# EAGLE design aasaver2.0 (EAGLE 6.4)
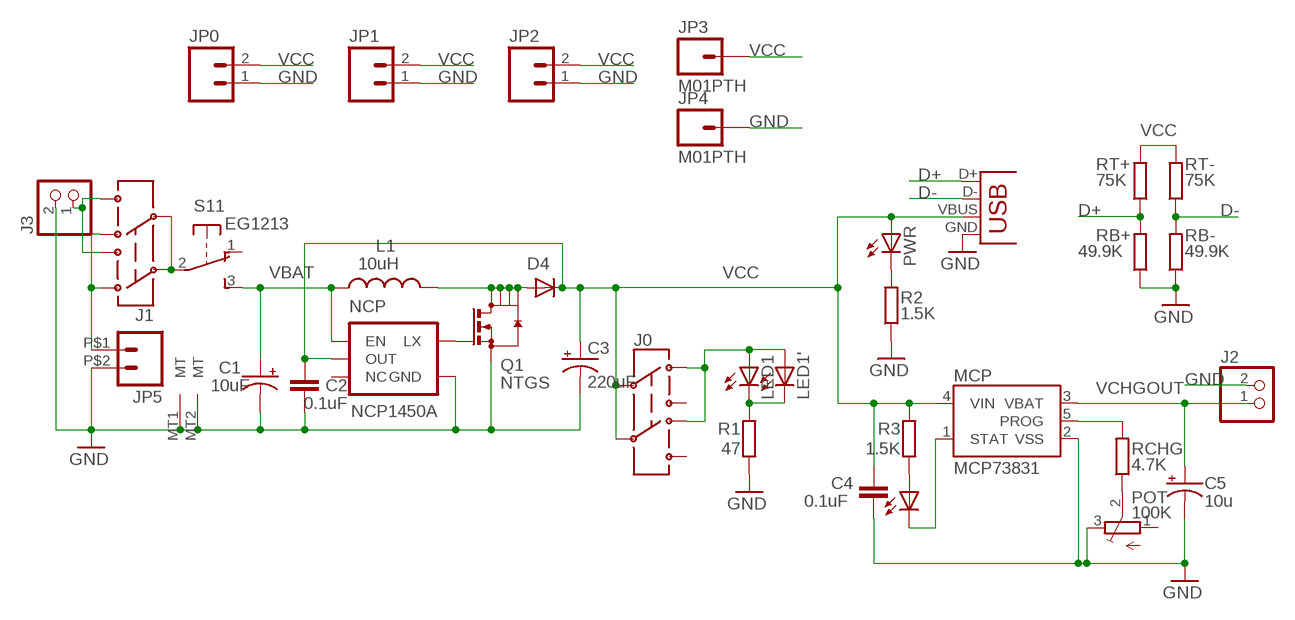
[diagram p0: schematic, sheet 1]

## Parts
C1  10uF  CAP_POL1206  [EIA3216]
C2  0.1uF  C-EUC0805  [C0805]
C3  220uF  CAP_POL7343  [EIA7343]
C4  0.1uF  C-EUC0805  [C0805]
C5  10u  CAP_POL1206  [EIA3216]
D4  DIODEDO216  [DO216AA-DIODE]
J0  AYZ0202  [AYZ0202]
J1  AYZ0202  [AYZ0202]
J2  JST_2PIN-SMT-RA  [JST-PH-2-SMT-RA]
J3  JST_2PIN-SMT-RA  [JST-PH-2-SMT-RA]
JP0  M021X02_NO_SILK  [1X02_NO_SILK]
JP1  M021X02_NO_SILK  [1X02_NO_SILK]
JP2  M021X02_NO_SILK  [1X02_NO_SILK]
JP3  M01PTH  [1X01]
JP4  M01PTH  [1X01]
JP5  M02PTH2  [1X02_BIG]
L1  10uH  INDUCTORCR75  [CR75]
LED1  LED3MM  [LED3MM]
LED1'  LED3MM  [LED3MM]
LED3  green  LEDCHIPLED_0805  [CHIPLED_0805]
MCP  MCP73831  [SOT23-5]
NCP  NCP1450A  V_REG_NCP1400SOT23-5  [SOT23-5]
POT  100K  TRIMPOTTC33X  [TC33X]
PWR  red  LEDCHIPLED_0805  [CHIPLED_0805]
Q1  NTGS  NTGS3446  [SOT236]
R1  47  R-EU_R0805  [R0805]
R2  1.5K  R-EU_R0805  [R0805]
R3  1.5K  R-EU_R0805  [R0805]
RB+  49.9K  R-EU_R0805  [R0805]
RB-  49.9K  R-EU_R0805  [R0805]
RCHG  4.7K  R-EU_R0805  [R0805]
RT+  75K  R-EU_R0805  [R0805]
RT-  75K  R-EU_R0805  [R0805]
S1  EG1213  [EG1213]
X1  USB-A-S-FEMALE  [USB-A-S-FEMALE]

## Nets
D+: RB+.2 RT+.1 X1.D+
D-: RB-.2 RT-.1 X1.D-
GND: C1.C(-) C2.1 C3.C(-) C4.2 C5.C(-) J2.2 J3.2 JP0.1 JP1.1 JP2.1 JP4.1 JP5.P$2 MCP.2(VSS) NCP.4(GND) POT.3(E) Q1.4(S) R1.1 R2.1 RB+.1 RB-.1 S1.MT1(MT) S1.MT2(MT) X1.GND
N$1: NCP.5(LX) Q1.3(G)
N$2 [power]: D4.A L1.P$2 Q1.1(D) Q1.2(D1) Q1.5(D2) Q1.6(D3)
N$3: J1.2 J1.5 S1.2(1:P)
N$4: LED1'.K(C) LED1.K(C) R1.2
N$5: LED3.A R3.1
N$6: J1.3 J1.6 JP5.P$1
N$7: POT.2(S) RCHG.1
N$8: PWR.C R2.2
N$9: LED3.C MCP.1(STAT)
N$10: MCP.5(PROG) RCHG.2
N$11: J1.1 J1.4 J3.1
N$14: J0.3 J0.6 LED1'.A LED1.A
VBAT [power]: C1.A(+) L1.P$1 NCP.1(EN) S1.3(1:S)
VCC [power]: C2.2 C3.A(+) C4.1 D4.C J0.2 J0.5 JP0.2 JP1.2 JP2.2 JP3.1 MCP.4(VIN) NCP.2(OUT) PWR.A R3.2 RT+.2 RT-.2 X1.VBUS
VCHGOUT: C5.A(+) J2.1 MCP.3(VBAT)
Unconnected: J0.1 J0.4 NCP.3(NC) POT.1(A) S1.1(1:O)

## Library data of the parts
C1 C3 C5 = SparkFunNew:CAP_POL: Capacitor Polarized These are standard SMD and PTH capacitors. Normally 10uF, 47uF, and 100uF in electrolytic and tantalum varieties. Always verify the external diameter of the through hole cap, it varies with capacity, voltage, and manufacturer. The EIA devices should be standard.
C2 C4 = resistor:C-EU: CAPACITOR, European symbol
D4 = SparkFun:DIODE: Diode These are standard reverse protection diodes and small signal diodes. SMA package can handle up to about 1A. SOD-323 can handle about 200mA. What the SOD-323 package when ordering, there are some mfgs out there that are 5-pin packages.
J0 J1 = SparkFunNew:AYZ0202: SPDT Slide Switch Simple SMD single-pull double-throw slide switch. Good for less than 350mA power switch, switching UARTs between devices, etc. Spark Fun Electronics SKU : COM-00597
J2 J3 = adafruit:JST_2PIN: JST 2-Pin Connectors of various flavors SMT-RA (S2B-PH-SM4) 4UConnector #17311 SMT (B2B-PH-SM4) THM-RA (S2B-PH) THM (B2B-PH)
JP0 JP1 JP2 JP5 = SparkFun:M02: Header 2 Standard 2-pin 0.1" header. Use with straight break away headers (SKU : PRT-00116), right angle break away headers (PRT-00553), swiss pins (PRT-00743), machine pins (PRT-00117), and female headers (PRT-00115). Molex polarized connector foot print use with SKU : PRT-08233 with associated crimp pins and housings.
JP3 JP4 = SparkFun:M01: Header 1 Standard 1-pin 0.1" header. Use with straight break away headers (SKU : PRT-00116), right angle break away headers (PRT-00553), swiss pins (PRT-00743), machine pins (PRT-00117), and female headers (PRT-00115).
L1 = SparkFun:INDUCTOR: Inductors Basic Inductor/Choke - 0603 and 1206. Footprints are not proven and vary greatly between part numbers.
LED1 LED1' = adafruit:LED: LED
LED3 PWR = led:LED: LED
MCP = SparkFunNew:MCP73831: Microchip's MCP73831 Miniature single cell, fully integrated Li-Ion, Li-polymer charge management controller http://ww1.microchip.com/downloads/en/DeviceDoc/21984a.pdf
NCP = SparkFunNew:V_REG_NCP1400: Switching step-up voltage regulator NCP1400 switiching regulator takes single cell AA and outputs 100mA at 3.3V or 5V with minimal number of external components.
POT = adafruit:TRIMPOT: SMT trimmer potentiometer part number TC33X http://www.ladyada.net/library/eagle
Q1 = transistor-small-signal:NTGS3446
R1-R3 RB+ RB- RCHG RT+ RT- = rcl:R-EU_: RESISTOR, European symbol
S1 = adafruitGood:EG1213: E-Switch right-angle slide SPDT Part #EG1213 http://www.ladyada.net/library/eagle
X1 = SparkFunNew:USB: USB Connectors USB-B-PTH is fully proven SKU : PRT-00139 USB-miniB is fully proven SKU : PRT-00587 USB-A-PCB is untested. USB-A-H is throughly reviewed, but untested. Spark Fun Electronics SKU : PRT-00437 USB-B-SMT is throughly reviewed, but untested. Needs silkscreen touching up. USB-A-S has not been used/tested USB-MB-H has not been used/tested

## Net classes
0 default: width 0.254 mm, clearance 0.203 mm
1 power: width 0.508 mm, clearance 0.203 mm

## Board
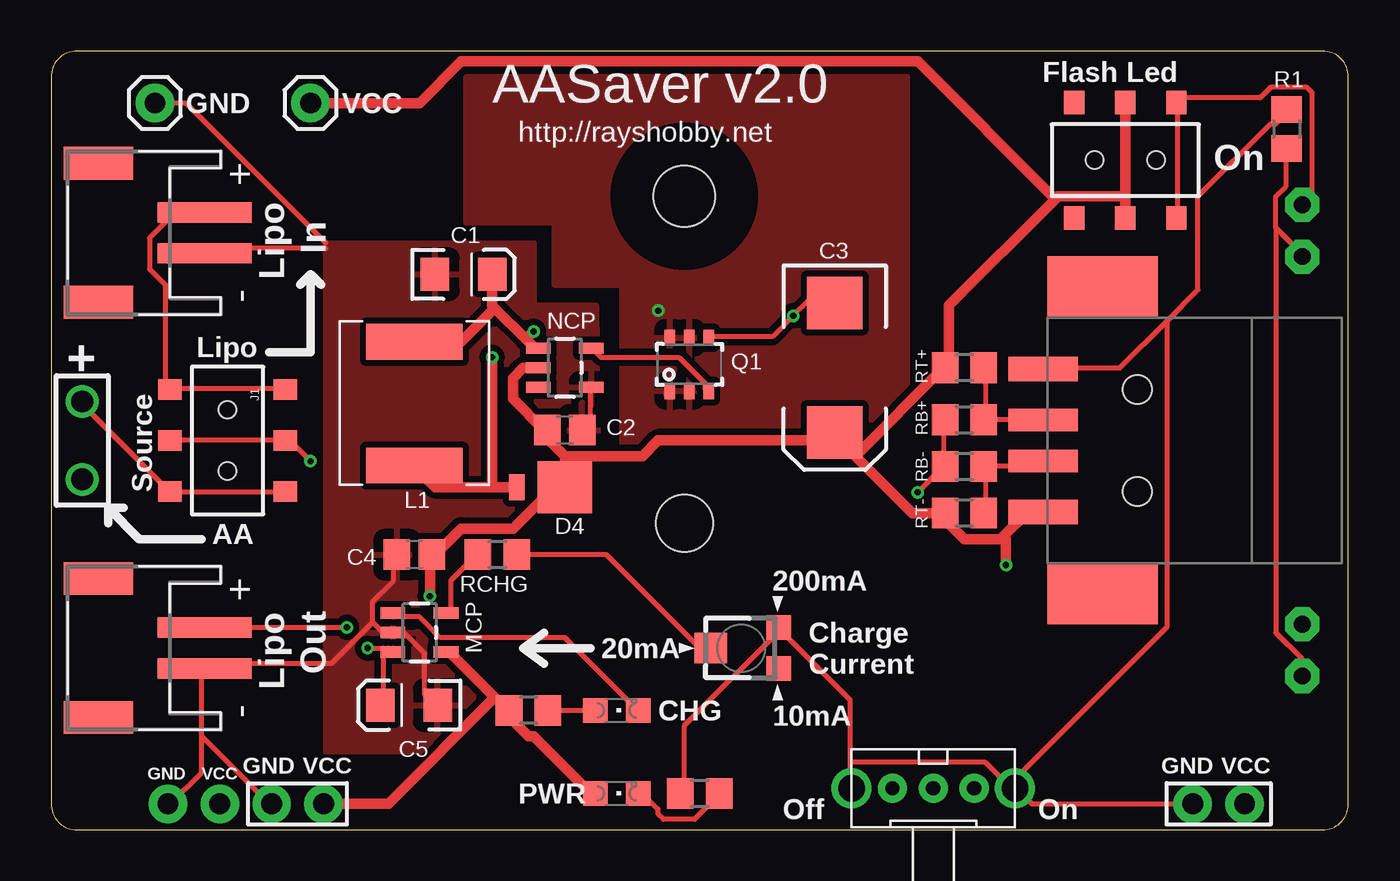
[diagram p1: board, top side]
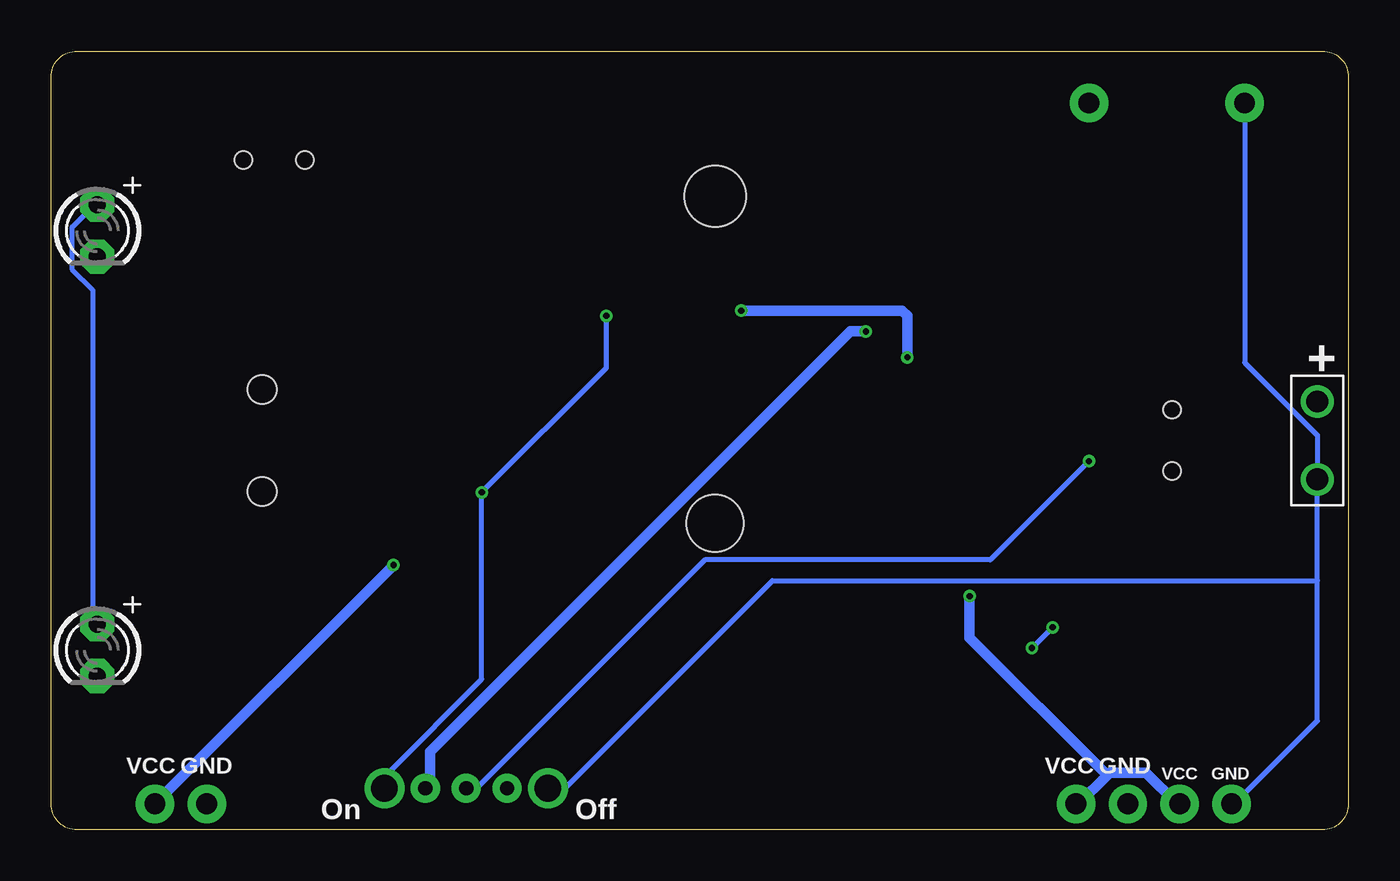
[diagram p2: board, bottom side, seen from below]

Size 63.5 x 38.1 mm. Coordinates in mm from the lower left corner, seen from the top.
Outline: 1.27,0 62.23,0 arc90 63.5,1.27 63.5,36.83 arc90 62.23,38.1 1.27,38.1 arc90 0,36.83 0,1.27 arc90 1.27,0
Copper layers (1*16): Top 0.035mm / dielectric 1.5mm / Bottom 0.035mm
Design rules "Fusion_eagle_rule_v1.1 *": minimum track width 6mil, minimum drill 12mil, track to track 6mil, track to pad 6mil, pad to pad 6mil, via to via 6mil, smd to smd 0mil, copper to edge 10mil, drill to drill 10mil, minimum pad ring 10mil, minimum via ring 6mil, stop-mask expansion 2mil, vias tented up to drill 100mil, thermal gap 20mil
Holes 3 mm at 31,31
Holes 2.8 mm at 31,15
tRestrict: area 27.7,27.7 to 34.3,34.3; area 27.7,11.7 to 34.3,18.3

### Footprints (pad centres in the part's own frame; a part is rotated, then mirrored left to right if it is on the bottom)
EIA3216 = smd 1.4 x 1.6: A 1.4,0; C -1.4,0
C0805 = smd 1.3 x 1.5: 1 -0.85,0; 2 0.85,0
EIA7343 = smd 2.55 x 2.7: A 3.17,0; C -3.17,0
DO216AA-DIODE = smd 0.762 x 1.27: A 2.349,0 | smd 2.667 x 2.54: C 0,0
AYZ0202 = smd 1 x 1.15: 1 -2.5,2.825; 2 0,2.825; 3 2.5,2.825; 4 -2.5,-2.825; 5 0,-2.825; 6 2.5,-2.825 | hole 0.85: 1.5,0; -1.5,0
JST-PH-2-SMT-RA = smd 1 x 4.6: 1 1,-3.7; 2 -1,-3.7 | smd 1.6 x 3.4: NC1 -3.4,1.5; NC2 3.4,1.5
1X02_NO_SILK = drill 1.016 pad 1.88: 1 0,0; 2 2.54,0
1X01 = drill 1.016 pad 1.88: 1 0,0
1X02_BIG = drill 1.067: P$1 0,0; P$2 3.81,0
CR75 = smd 1.75 x 4.7: P$1 0,0; P$2 6.05,0
LED3MM = drill 0.813 pad 1.676 octagon: A -1.27,0; K 1.27,0
CHIPLED_0805 = smd 1.2 x 1.2: A 0,-1.05; C 0,1.05
SOT23-5 = smd 0.55 x 1.2: 1 -0.95,-1.3; 2 0,-1.3; 3 0.95,-1.3; 4 0.95,1.3; 5 -0.95,1.3
TC33X = smd 1.2 x 1.2: 1 -1,-1.825; 3 1,-1.825 | smd 1.5 x 1.6: 2 0,1.5
SOT236 = smd 0.51 x 0.8: 1 -0.95,-1.3; 2 0,-1.3; 3 0.95,-1.3; 4 0.95,1.3; 5 0,1.3; 6 -0.95,1.3
R0805 = smd 1.3 x 1.5: 1 -0.95,0; 2 0.95,0
EG1213 = drill 0.7 pad 1.422: 1 -2,0; 2 0,0; 3 2,0 | drill 1.3 pad 1.95: MT1 -4,0; MT2 4,0
USB-A-S-FEMALE = smd 1.1 x 3.4: D+ 1,0.2; D- -1,0.2 | smd 1.2 x 3.4: GND 3.5,0.2; VBUS -3.5,0.2 | smd 3 x 5.4: P$1 -7.5,-2.7; P$2 7.5,-2.7 | hole 1.4: -2.5,-4.4; 2.5,-4.4

### Placement (x,y rotation side)
C1  20.19,27.18 0 top
C2  25.15,19.56 180 top
C3  38.35,22.61 270 top
C4  17.78,13.46 180 top
C5  17.53,6.1 180 top
D4  25.15,16.76 180 top
J0  52.58,32.77 0 top
J1  8.64,19.05 270 top
J2  3.81,8.89 90 top
J3  3.81,29.21 90 top
JP0  55.88,1.27 0 top
JP1  10.79,1.27 0 top
JP2  5.71,1.27 0 top
JP3  12.7,35.56 0 top
JP4  5.08,35.56 0 top
JP5  1.52,20.95 270 bottom
L1  17.78,23.88 270 top
LED1  61.24,29.31 270 bottom
LED1'  61.24,8.79 270 bottom
LED3  27.69,5.84 270 top
MCP  18.03,9.65 270 top
NCP  25.15,22.61 270 top
POT  33.78,8.89 90 top
PWR  27.69,1.78 270 top
Q1  31.24,22.77 0 top
R1  60.48,34.29 270 top
R2  31.75,1.78 0 top
R3  23.37,5.84 180 top
RB+  44.7,20.07 0 top
RB-  44.7,17.78 0 top
RCHG  21.84,13.46 180 top
RT+  44.7,22.61 180 top
RT-  44.7,15.49 180 top
S1  43.18,2.03 0 top
X1  48.77,19.05 90 top

### Tracks (layer width: path | path; a pad name or v marks a point on that pad's centre or on a via)
D+
  Top 0.254: 45.72,20.07 45.72,22.61 RT+.1 | 45.72,20.07 48.51,20.07 X1.D+ | 45.72,20.07 RB+.2
D-
  Top 0.254: 45.72,17.78 45.72,15.49 RT-.1 | 45.72,17.78 48.26,17.78 48.51,18.03 X1.D- | 45.72,17.78 RB-.2
GND  (via drill 0.3)
  Top 0.254: NCP.4 26.42,21.59 26.42,19.81 26.16,19.56 C2.1 | JP4.1 6.6,35.56 13.46,28.7 | 39.12,3.3 39.12,2.03 S1.MT1 | 39.12,3.3 39.12,6.35 35.81,9.65 POT.3 35.56,9.65 30.99,5.08 30.99,1.78 R2.1 | Q1.4 32.26,24.13 35.31,24.13 v36.32,25.15 37.08,25.91 38.35,25.91 C3.C | 43.69,17.78 43.69,20.07 RB+.1 | v42.42,16.51 43.69,17.78 | 43.69,17.78 RB-.1 | 39.12,3.3 45.72,3.3 46.99,2.03 S1.MT2 47.24,2.03 | 13.46,28.45 7.62,28.45 J3.2 | 7.37,4.57 7.37,2.79 5.84,1.27 JP2.1 | 7.37,4.57 7.37,7.87 J2.2 7.62,8.13 13.72,8.13 15.75,10.16 | 7.37,4.57 10.67,1.27 JP1.1 | C5.C 18.8,6.1 18.29,6.6 18.29,8.64 17.27,9.65 MCP.2 16.26,9.65 15.75,10.16 | 15.75,10.16 15.75,11.18 16.76,12.19 16.76,13.46 C4.2 | JP0.1 48.01,1.27 47.24,2.03 | 54.61,24.89 52.32,22.61 48.77,22.61 X1.GND | 54.61,24.89 56.13,26.42 56.13,30.99 59.69,34.54 59.94,34.54 60.45,35.05 R1.1 | 47.24,2.03 47.24,2.54 54.61,9.91 54.61,24.89
  Bottom 0.254: 1.52,12.19 1.52,5.33 5.59,1.27 JP2.1 | 1.52,12.19 JP5.P$2 1.52,19.3 5.08,22.86 JP4.1 | 1.52,12.19 28.19,12.19 38.35,2.03 S1.MT1 | S1.MT2 46.99,2.03 46.99,2.79 42.42,7.37 v42.42,16.51 36.32,22.61 v36.32,25.15
  pour Top (isolate 0.305): 13.46,28.7 23.62,28.7 23.62,25.65 26.67,25.65 26.92,3.81 13.46,3.81
N$1
  Top 0.254: Q1.3 32,21.59 32,21.84 30.73,23.11 26.92,23.11 26.67,23.37 NCP.5
N$2  (via drill 0.3)
  Top 0.508: 21.59,16.76 18.8,16.76 17.78,17.78 L1.P$2 | 21.59,16.76 D4.A | 30.23,21.34 Q1.1 | v21.59,23.11 21.59,16.76
  Bottom 0.508: v21.59,23.11 21.59,25.15 21.84,25.4 v29.72,25.4
  pour Top (isolate 0.305): 27.94,15.24 41.91,15.24 41.91,36.83 20.32,36.83 20.32,29.72 24.64,29.72 24.64,26.67 27.94,26.67
N$3  (via drill 0.3)
  Top 0.254: J1.5 J1.2 11.68,19.05 v12.7,18.03
  Bottom 0.254: S1.2 42.67,2.03 31.5,13.21 17.53,13.21 v12.7,18.03
N$4
  Top 0.254: 59.94,29.46 59.94,30.99 60.45,31.5 60.45,33.27 R1.2 | 59.94,29.46 61.21,28.19 LED1.K | 59.94,29.46 59.94,9.65 61.21,8.38 61.21,7.62 LED1'.K
N$5
  Top 0.254: R3.1 LED3.A
N$6
  Top 0.254: J1.3 11.43,16.51 5.84,16.51 J1.6 5.59,16.76 1.52,20.83 JP5.P$1
N$7
  Top 0.254: RCHG.1 27.18,13.46 31.75,8.89 POT.2
N$8
  Top 0.254: PWR.C 28.96,1.78 29.72,1.02 29.72,0.76 29.97,0.51 31.5,0.51 32.77,1.78 R2.2
N$9
  Top 0.254: MCP.1 16.76,10.41 18.03,10.41 19.05,9.4 25.15,9.4 28.7,5.84 LED3.C
N$10
  Top 0.254: MCP.5 19.56,10.67 19.56,12.19 20.83,13.46 RCHG.2
N$11
  Top 0.254: J1.1 11.43,21.59 5.84,21.59 J1.4 5.59,21.59 5.59,26.67 4.83,27.43 4.83,28.96 5.84,29.97 7.37,29.97 J3.1
N$14
  Top 0.254: J0.6 55.12,29.97 55.12,35.56 J0.3 55.12,35.81 59.18,35.81 59.69,36.32 61.47,36.32 61.72,36.07 61.72,30.99 61.47,30.73 LED1.A
  Bottom 0.254: LED1'.A 61.47,10.16 61.47,26.42 62.48,27.43 62.48,29.46 61.47,30.48 LED1.A
VBAT  (via drill 0.3)
  Top 0.508: 21.72,25.53 21.59,25.65 C1.A | 21.72,25.53 23.24,24 | 23.24,24 23.62,23.62 NCP.1 | 23.24,24 v23.62,24.38 | L1.P$1 20.07,23.88 21.72,25.53
  Bottom 0.508: v23.62,24.38 24.38,24.38 44.96,3.81 44.96,2.03 S1.3
VCC  (via drill 0.3)
  Top 0.508: PWR.A 26.42,1.78 23.62,4.57 23.37,4.57 22.61,5.33 22.61,5.84 R3.2 22.35,5.84 21.72,6.48 | v18.54,11.43 18.54,13.46 C4.1 18.8,13.46 20.07,14.73 22.61,14.73 24.64,16.76 D4.C 25.15,18.29 | J0.2 52.58,30.99 | 52.58,30.99 J0.5 | 52.58,30.99 49.28,30.99 49.15,30.86 | 49.15,30.86 43.94,25.65 43.94,22.61 RT+.2 43.69,22.61 39.37,18.29 | NCP.2 23.11,22.61 22.61,22.1 22.61,21.08 24.13,19.56 C2.2 23.88,19.56 25.15,18.29 | 43.43,15.49 42.16,15.49 39.37,18.29 | 43.43,15.49 RT-.2 | 39.37,18.29 38.35,19.3 C3.A | 46.61,14.35 46.48,14.22 44.7,14.22 43.43,15.49 | 46.61,14.35 47.75,15.49 48.51,15.49 X1.VBUS | v46.74,12.95 46.74,14.22 46.61,14.35 | 25.15,18.29 28.96,18.29 29.72,19.05 38.35,19.05 C3.A | 39.37,18.29 C3.A | JP3.1 18.03,35.56 20.07,37.59 42.42,37.59 49.15,30.86 | 21.72,6.48 19.56,8.64 MCP.4 | 21.72,6.48 16.51,1.27 JP1.2
  Bottom 0.508: 11.81,2.67 13.21,1.27 JP1.2 | 11.81,2.67 11.68,2.79 9.91,2.79 8.38,1.27 JP2.2 | v18.54,11.43 18.54,9.4 11.81,2.67 | v46.74,12.95 JP0.2
VCHGOUT  (via drill 0.3)
  Top 0.254: 16.76,8.89 MCP.3 | v15.49,8.89 16.26,8.89 | 16.26,8.89 16.51,8.89 MCP.3 | v14.48,9.91 7.62,9.91 J2.1 | 16.26,8.89 16.26,6.1 C5.A | 16.26,8.89 MCP.3
  Bottom 0.254: v14.48,9.91 v15.49,8.89

### Text on the board
tNames: Flash Led | AASaver v2.0 | GND | VCC | http://rayshobby.net | On | In | Lipo | Lipo | + | Source | AA | 200mA | Charge | Out | 20mA | Current | Lipo | CHG | 10mA | GND | VCC | GND | VCC | GND | VCC | Off | On
bNames: + | GND | VCC | GND | VCC | GND | VCC | Off | On